# Altium project Sunfish_ECU_RevA.PrjPcb
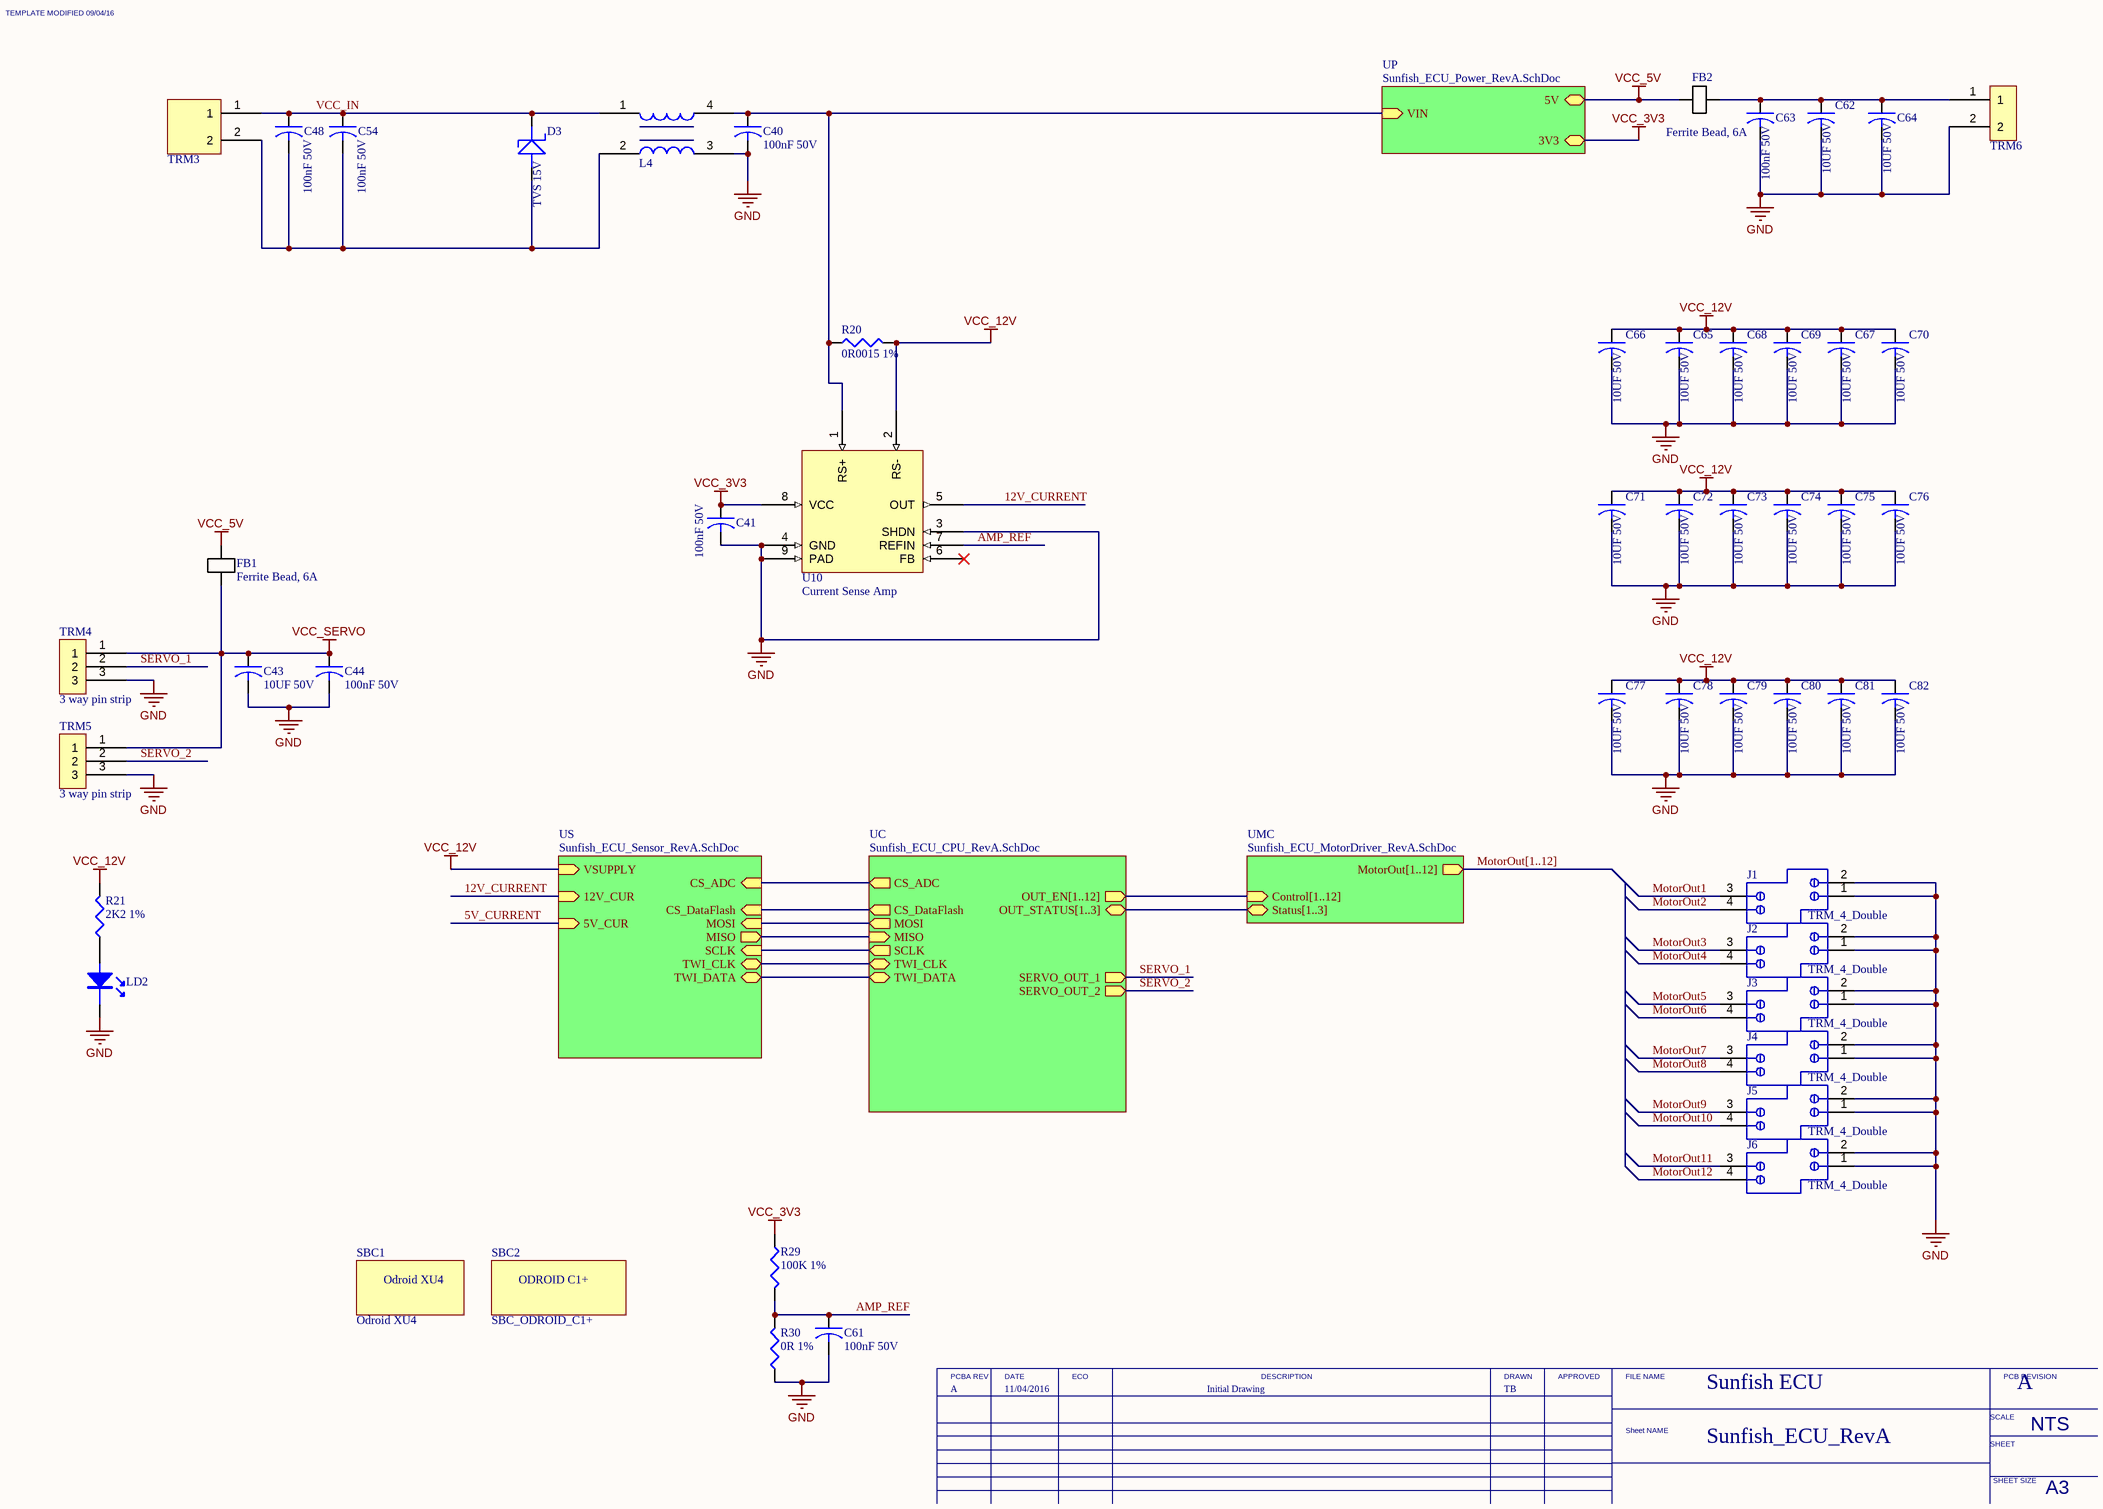
[diagram p0: Sunfish_ECU_RevA.SchDoc]
6 sheets, 197 parts. Net scope: hierarchical (ports join the sheet entries above them; power ports are global).
Board file: Sunfish_ECU_RevA.PcbDoc
Sheets:
  Sunfish_ECU_RevA.SchDoc
    UP = Sunfish_ECU_Power_RevA.SchDoc
    UC = Sunfish_ECU_CPU_RevA.SchDoc
    UMC = Sunfish_ECU_MotorDriver_RevA.SchDoc
      UF1 = Sunfish_ECU_MotorFilter_RevA.SchDoc
      UF2 = Sunfish_ECU_MotorFilter_RevA.SchDoc
      UF3 = Sunfish_ECU_MotorFilter_RevA.SchDoc
      UF4 = Sunfish_ECU_MotorFilter_RevA.SchDoc
      UF5 = Sunfish_ECU_MotorFilter_RevA.SchDoc
      UF6 = Sunfish_ECU_MotorFilter_RevA.SchDoc
      UF7 = Sunfish_ECU_MotorFilter_RevA.SchDoc
      UF8 = Sunfish_ECU_MotorFilter_RevA.SchDoc
      UF9 = Sunfish_ECU_MotorFilter_RevA.SchDoc
      UF10 = Sunfish_ECU_MotorFilter_RevA.SchDoc
      UF11 = Sunfish_ECU_MotorFilter_RevA.SchDoc
      UF12 = Sunfish_ECU_MotorFilter_RevA.SchDoc
    US = Sunfish_ECU_Sensor_RevA.SchDoc

## Sheet Sunfish_ECU_RevA.SchDoc
size A3; _PRJ_TITLE: PROJECT TITLE; _SHT_TITLE: Sheet; _REV: A; PageSetup: Record=PageOptions|CenterHorizontal=True|CenterVertical=True|PrintScale=0.71|XCorrection=1.00|YCorrection=1.00|PrintKind=0|BorderSize=5000000|LeftOffset=0|BottomOffset=0|Orientation=2|PaperLength=1000|PaperWidth=1000|Scale=100|PaperSource=258|PrintQuality=600|MediaType=1|DitherType=10|PaperKind=A3 (297x420mm)|PrintScaleMode=1

### Parts
C40  100nF 50V  [0603]
C41  100nF 50V  [0603]
C43  10UF 50V  [1206]
C44  100nF 50V  [0603]
C48  100nF 50V  [0603]
C54  100nF 50V  [0603]
C61  100nF 50V  [0603]
C62  10UF 50V  [1206]
C63  100nF 50V  [0603]
C64  10UF 50V  [1206]
C65  10UF 50V  [1206]
C66  10UF 50V  [1206]
C67  10UF 50V  [1206]
C68  10UF 50V  [1206]
C69  10UF 50V  [1206]
C70  10UF 50V  [1206]
C71  10UF 50V  [1206]
C72  10UF 50V  [1206]
C73  10UF 50V  [1206]
C74  10UF 50V  [1206]
C75  10UF 50V  [1206]
C76  10UF 50V  [1206]
C77  10UF 50V  [1206]
C78  10UF 50V  [1206]
C79  10UF 50V  [1206]
C80  10UF 50V  [1206]
C81  10UF 50V  [1206]
C82  10UF 50V  [1206]
D3  TVS 15V  [DO-214AB]
FB1  Ferrite Bead, 6A  [1806]
FB2  Ferrite Bead, 6A  [1806]
J1  TRM_4_Double  [691230110004]
J2  TRM_4_Double  [691230110004]
J3  TRM_4_Double  [691230110004]
J4  TRM_4_Double  [691230110004]
J5  TRM_4_Double  [691230110004]
J6  TRM_4_Double  [691230110004]
L4  CHOKE COM MODE ULTRA HC 100 OHMS  [Choke_CM5441Z101B-10]  (value not drawn)
LD2  Green LED 0805  [0805DIODE]  (value not drawn)
R20  0R0015 1%  [2512]
R21  2K2 1%  [0603]
R29  100K 1%  [0603]
R30  0R 1%  [0603]
SBC1  Odroid XU4  [ODROID_XU4]
SBC2  SBC_ODROID_C1+  [SBC_ODROID_C1+]
TRM3  2way screw terminal, High current  [TERM_2POS_HORIZ_7.62MM]  (value not drawn)
TRM4  3 way pin strip  [SIP_3]
TRM5  3 way pin strip  [SIP_3]
TRM6  Wurth 2way screw terminal  [TERM_2POS_HORIZ_5.08MM]  (value not drawn)
U10  Current Sense Amp  [SOIC127P600X168_HS-8M]

### Sub-sheets
UC = Sunfish_ECU_CPU_RevA.SchDoc: OUT_EN[1..12] (out), CS_ADC (out), MOSI (out), TWI_DATA (bidir), TWI_CLK (bidir), OUT_STATUS[1..3] (bidir), SCLK (out), CS_DataFlash (out), MISO (in), SERVO_OUT_1 (out), SERVO_OUT_2 (out)
UMC = Sunfish_ECU_MotorDriver_RevA.SchDoc: MotorOut[1..12] (out), Control[1..12] (in), Status[1..3] (bidir)
UP = Sunfish_ECU_Power_RevA.SchDoc: 5V (bidir), 3V3 (bidir), VIN (in)
US = Sunfish_ECU_Sensor_RevA.SchDoc: 12V_CUR (in), VSUPPLY (in), CS_ADC (in), TWI_DATA (bidir), CS_DataFlash (in), SCLK (in), TWI_CLK (bidir), MOSI (in), MISO (out), 5V_CUR (in)

### Nets
GND: C40.2 C41.2 C43.2 C44.2 C61.2 C62.2 C63.2 C64.2 C65.2 C66.2 C67.2 C68.2 C69.2 C70.2 C71.2 C72.2 C73.2 C74.2 C75.2 C76.2 C77.2 C78.2 C79.2 C80.2 C81.2 C82.2 J1.1 J1.2 J2.1 J2.2 J3.1 J3.2 J4.1 J4.2 J5.1 J5.2 J6.1 J6.2 L4.3 LD2.K R30.1 TRM4.3 TRM5.3 TRM6.2 U10.3(SHDN) U10.4(GND) U10.9(PAD)
VCC_3V3: C41.1 R29.2 U10.8(VCC) ; sheet UP/3V3
VCC_5V: FB1.1 FB2.1 ; sheet UP/5V
VCC_12V: C65.1 C66.1 C67.1 C68.1 C69.1 C70.1 C71.1 C72.1 C73.1 C74.1 C75.1 C76.1 C77.1 C78.1 C79.1 C80.1 C81.1 C82.1 R20.2 R21.2 U10.2(RS-) ; sheet US/VSUPPLY
VCC_SERVO: C43.1 C44.1 FB1.2 TRM4.1 TRM5.1
5V_CURRENT: sheet US/5V_CUR
12V_CURRENT: U10.5(OUT) ; sheet US/12V_CUR
AMP_REF: C61.1 R29.1 R30.2 U10.7(REFIN)
CS_ADC: sheet UC/CS_ADC, sheet US/CS_ADC
CS_DataFlash: sheet UC/CS_DataFlash, sheet US/CS_DataFlash
MISO: sheet UC/MISO, sheet US/MISO
MOSI: sheet UC/MOSI, sheet US/MOSI
MotorOut1: J1.3
MotorOut2: J1.4
MotorOut3: J2.3
MotorOut4: J2.4
MotorOut5: J3.3
MotorOut6: J3.4
MotorOut7: J4.3
MotorOut8: J4.4
MotorOut9: J5.3
MotorOut10: J5.4
MotorOut11: J6.3
MotorOut12: J6.4
SCLK: sheet UC/SCLK, sheet US/SCLK
SERVO_1: TRM4.2 ; sheet UC/SERVO_OUT_1
SERVO_2: TRM5.2 ; sheet UC/SERVO_OUT_2
TWI_CLK: sheet UC/TWI_CLK, sheet US/TWI_CLK
TWI_DATA: sheet UC/TWI_DATA, sheet US/TWI_DATA
VCC_IN: C48.1 C54.1 D3.K L4.1 TRM3.1
NetC40_1: C40.1 L4.4 R20.1 U10.1(RS+) ; sheet UP/VIN
NetC48_2: C48.2 C54.2 D3.A L4.2 TRM3.2
NetC62_1: C62.1 C63.1 C64.1 FB2.2 TRM6.1
NetLD2_A: LD2.A R21.1

Not connected (* = marked no-connect by the designer): U10 6(FB)*

### Buses and harness runs
bus MotorOut[1..12] = sheet UMC/MotorOut[1..12]
bus sheet UC/OUT_EN[1..12] = sheet UMC/Control[1..12]
bus sheet UC/OUT_STATUS[1..3] = sheet UMC/Status[1..3]

### Notes on the sheet
- A
- 11/04/2016
- Initial Drawing
- TB
- Sunfish ECU
- Sunfish_ECU_RevA
- TEMPLATE MODIFIED 09/04/16
- PCBA REV
- DATE
- ECO
- DESCRIPTION
- DRAWN
- APPROVED
- FILE NAME
- PCB REVISION
- Sheet NAME
- SCALE
- SHEET
- NTS
- SHEET SIZE
- A3
- (in symbol SBC_ODROID_C1+) ODROID C1+

### Library data of the parts
C40 C41 C44 C48 C54 C61 C63 = CAP_100NF_50V_10%_0603: CAP CER 100nF 50V 10% X7R 0603; Manufacturer: Murata; Manufacturer P/N: GRM188R71H104KA93D
C43 C62 C64-C82 = CAP_10UF_50V_10%_1206: CAP CER 10UF 50V 10% X5R 1206; Manufacturer: Murata; Manufacturer P/N: GRM31CR61H106KA12L
D3 = DIODE_TVS_SMCJ15A: TVS Diode, 15V; Manufacturer: LIttlefuse; Manufacturer P/N: SMCJ15A
FB1 FB2 = IND_FERRITE_ BLM41PG600SN1L: Manufacturer: MURATA; Manufacturer P/N: BLM41PG600SN1L
J1-J6 = TRM_4_Double: WR-TBL Terminal Blocks Serie 2301 - 3.50 mm with Rising Clamp; Manufacturer: Würth Elektronik eiSos GmbH; ComponentLink1 Description: Manufacturer; ComponentLink2 Description: Datasheet; NoPins: 4; Created Date: 8 Novenber 2013; partNo: 691230110004; ComponentLink1URL: http://www.we-online.com; ComponentLink2URL: http://katalog.we-online.de/em/datasheet/6912301100xx.pdf; Created by: Karrer Zheng
L4 = CHOKE_COM_MODE_100MHz: Manufacturer: Laird-Signal Integrity Products; Manufacturer P/N: CM5441Z101B-10
LD2 = LED_Green_0805: WL-SMCW SMD CHIP LED WATERCLEAR; Manufacturer: Wurth; Manufacturer P/N: 150080VS75000
R20 = RES_0R0015_1%_2512: Resistor, 0R0015, 1%, 2512; Manufacturer: Riedon; Manufacturer P/N: CSR2512C0R0015F
R21 = RES_2K2_1%_0603: Resistor, 2K2, 1%, 0603; Manufacturer: Bourns Inc; Manufacturer P/N: CR0603-FX-2201ELF
R29 = RES_100K_1%_0603: Resistor, 100K, 1%, 0603; Manufacturer: Bourns Inc; Manufacturer P/N: CRT0603-BY-1003ELF
R30 = RES_0R_1%_0603_1: Resistor, 0R, 1%, 0603; Manufacturer: Bourns Inc; Manufacturer P/N: CR0603-J/-000ELF
SBC1 = SBC_ODROID_XU4
TRM3 = TRM_2way_ScrewTerminal_7.62mm: TERM BLOCK 2POS HORIZ 7.62MM T/H; Manufacturer: Altronics; Manufacturer P/N: P4343
TRM4 TRM5 = TRM_3WaySocket: Manufacturer: N/A; Manufacturer P/N: N/A
TRM6 = TRM_2way_ScrewTerminal: TERM BLOCK 2POS HORIZ 5.08MM T/H; Manufacturer: Wurth Electronics Inc; Manufacturer P/N: 691216510002
U10 = IC_OPAMP_MAX9920+: IC OPAMP CURR SENSE 230KHZ 8SOIC; Manufacturer: Maxim Intergrated; Manufacturer P/N: MAX9920ASA+

## Sheet Sunfish_ECU_Power_RevA.SchDoc
size A3; _PRJ_TITLE: PROJECT TITLE; _SHT_TITLE: Sheet; _REV: A; PageSetup: Record=PageOptions|CenterHorizontal=True|CenterVertical=True|PrintScale=0.71|XCorrection=1.00|YCorrection=1.00|PrintKind=0|BorderSize=5000000|LeftOffset=0|BottomOffset=0|Orientation=2|PaperLength=1000|PaperWidth=1000|Scale=100|PaperSource=258|PrintQuality=600|MediaType=1|DitherType=10|PaperKind=A3 (297x420mm)|PrintScaleMode=1
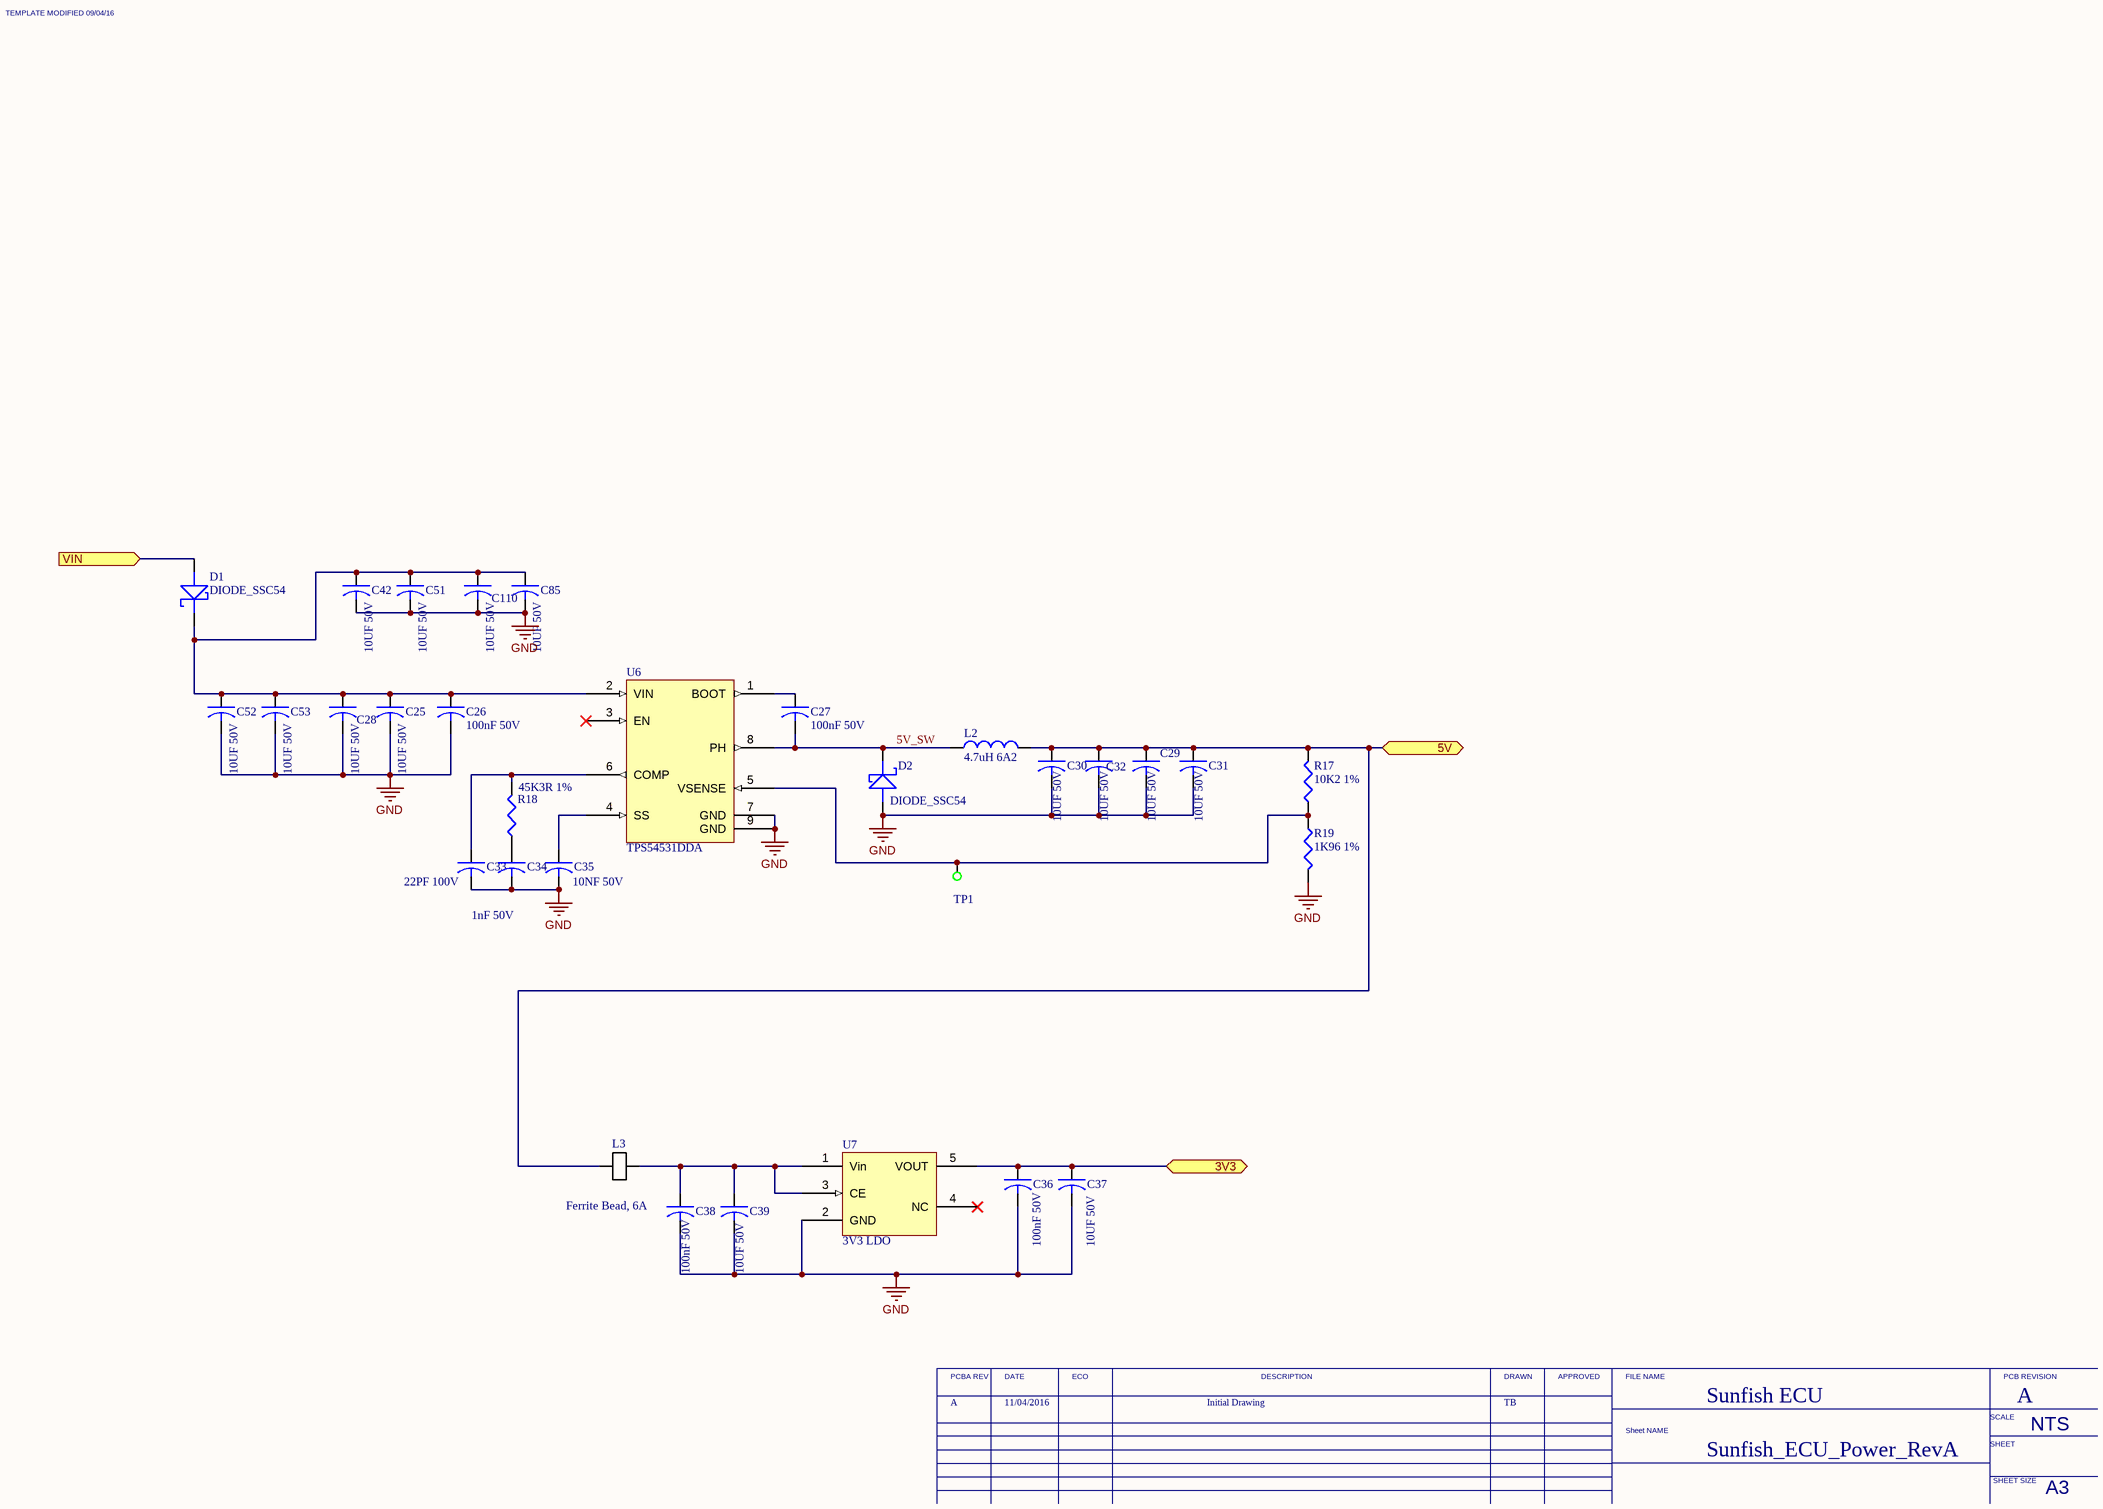
[diagram p1: Sunfish_ECU_Power_RevA.SchDoc]

### Parts
C25  10UF 50V  [1206]
C26  100nF 50V  [0603]
C27  100nF 50V  [0603]
C28  10UF 50V  [1206]
C29  10UF 50V  [1206]
C30  10UF 50V  [1206]
C31  10UF 50V  [1206]
C32  10UF 50V  [1206]
C33  22PF 100V  [0603]
C34  1nF 50V  [0603]
C35  10NF 50V  [0603]
C36  100nF 50V  [0603]
C37  10UF 50V  [1206]
C38  100nF 50V  [0603]
C39  10UF 50V  [1206]
C42  10UF 50V  [1206]
C51  10UF 50V  [1206]
C52  10UF 50V  [1206]
C53  10UF 50V  [1206]
C85  10UF 50V  [1206]
C110  10UF 50V  [1206]
D1  DIODE_SSC54  [DO-214AB]
D2  DIODE_SSC54  [DO-214AB]
L2  4.7uH 6A2  [Wurth744771156]
L3  Ferrite Bead, 6A  [1806]
R17  10K2 1%  [0603]
R18  45K3R 1%  [0603]
R19  1K96 1%  [0603]
TP1  Test Point  [TP_SMT]  (value not drawn)
U6  TPS54531DDA  [PSOP-8]
U7  3V3 LDO  [SOT-25-A]

### Ports
3V3 (bidir), 5V (bidir), VIN (in)

### Nets
GND: C25.2 C26.2 C28.2 C29.2 C30.2 C31.2 C32.2 C33.2 C34.2 C35.2 C36.2 C37.2 C38.2 C39.2 C42.2 C51.2 C52.2 C53.2 C85.2 C110.2 D2.A R19.2 U6.7(GND) U6.9(GND) U7.2(GND)
VCC_3V3: C36.1 C37.1 U7.5(VOUT) ; port 3V3
VCC_5V: C29.1 C30.1 C31.1 C32.1 L2.2 L3.1 R17.2 ; port 5V
5V_SW: C27.2 D2.K L2.1 U6.8(PH)
NetC25_1: C25.1 C26.1 C28.1 C42.1 C51.1 C52.1 C53.1 C85.1 C110.1 D1.K U6.2(VIN)
NetC27_1: C27.1 U6.1(BOOT)
NetC33_1: C33.1 R18.2 U6.6(COMP)
NetC34_1: C34.1 R18.1
NetC35_1: C35.1 U6.4(SS)
NetC38_1: C38.1 C39.1 L3.2 U7.1(Vin) U7.3(CE)
NetC40_1: D1.A ; port VIN
NetR17_1: R17.1 R19.1 TP1.1 U6.5(VSENSE)

Not connected (* = marked no-connect by the designer): U6 3(EN)*; U7 4(NC)*

### Notes on the sheet
- A
- 11/04/2016
- Initial Drawing
- TB
- Sunfish ECU
- Sunfish_ECU_Power_RevA
- TEMPLATE MODIFIED 09/04/16
- PCBA REV
- DATE
- ECO
- DESCRIPTION
- DRAWN
- APPROVED
- FILE NAME
- PCB REVISION
- Sheet NAME
- SCALE
- SHEET
- NTS
- SHEET SIZE
- A3

### Library data of the parts
C25 C28-C32 C37 C39 C42 C51-C53 C85 C110 = CAP_10UF_50V_10%_1206: as C43 on sheet Sunfish_ECU_RevA
C26 C27 C36 C38 = CAP_100NF_50V_10%_0603: as C40 on sheet Sunfish_ECU_RevA
C33 = CAP_22PF_100V_5%_0603: CAP CER 22PF 100V 5% NP0 0603; Manufacturer: Murata; Manufacturer P/N: GRM1885C2A220JA01D
C34 = CAP_1NF_50V_10%_0603: CAP CER 1nF 50V 10% X7R 0603; Manufacturer: Murata; Manufacturer P/N: GRM188R71H102KA01D
C35 = CAP_10NF_50V_10%_0603: CAP CER 10NF 50V 10% X7R 0603; Manufacturer: Murata; Manufacturer P/N: GRM188R71H103KA01D
D1 D2 = DIODE_SSC54: Schottky Diode, 5A, 40V SSC54, DO214AB; Manufacturer: Vishay; Manufacturer P/N: SSC54-E3/9AT
L2 = IND_4.7uH_6A2: FIXED IND 4.7UH 6.2A 34 MOHM; Manufacturer: Wurth Electronics Inc; Manufacturer P/N: 74437356047
L3 = IND_FERRITE_ BLM41PG600SN1L: Manufacturer: MURATA; Manufacturer P/N: BLM41PG600SN1L
R17 = RES_10K2_1%_0603: Resistor, 10K2, 1%, 0603; Manufacturer: Yageo; Manufacturer P/N: RC0603FR-0710K2L
R18 = RES_45K3_1%_0603: Resistor, 45K3, 1%, 0603; Manufacturer: Bourns Inc; Manufacturer P/N: CR0603-FX-4532ELF
R19 = RES_1K96_1%_0603: Resistor, 1K96, 1%, 0603; Manufacturer: Yageo; Manufacturer P/N: RC0603FR-071K96L
TP1 = MISC_TP_SMT: Probe compatible test point; Manufacturer: N/A; Manufacturer P/N: N/A
U6 = IC_SMPS_TPS54531: SMPS; Manufacturer: TI; Manufacturer P/N: TPS54531DDA
U7 = IC_XC6210B332MR-G: IC REG LDO 3.3V 0.7A SOT25; Manufacturer: Torex Semiconductor Ltd; Manufacturer P/N: XC6210B332MR-G

## Sheet Sunfish_ECU_CPU_RevA.SchDoc
size A3; _PRJ_TITLE: PROJECT TITLE; _SHT_TITLE: Sheet; _REV: A; PageSetup: Record=PageOptions|CenterHorizontal=True|CenterVertical=True|PrintScale=0.71|XCorrection=1.00|YCorrection=1.00|PrintKind=0|BorderSize=5000000|LeftOffset=0|BottomOffset=0|Orientation=2|PaperLength=1000|PaperWidth=1000|Scale=100|PaperSource=258|PrintQuality=600|MediaType=1|DitherType=10|PaperKind=A3 (297x420mm)|PrintScaleMode=1
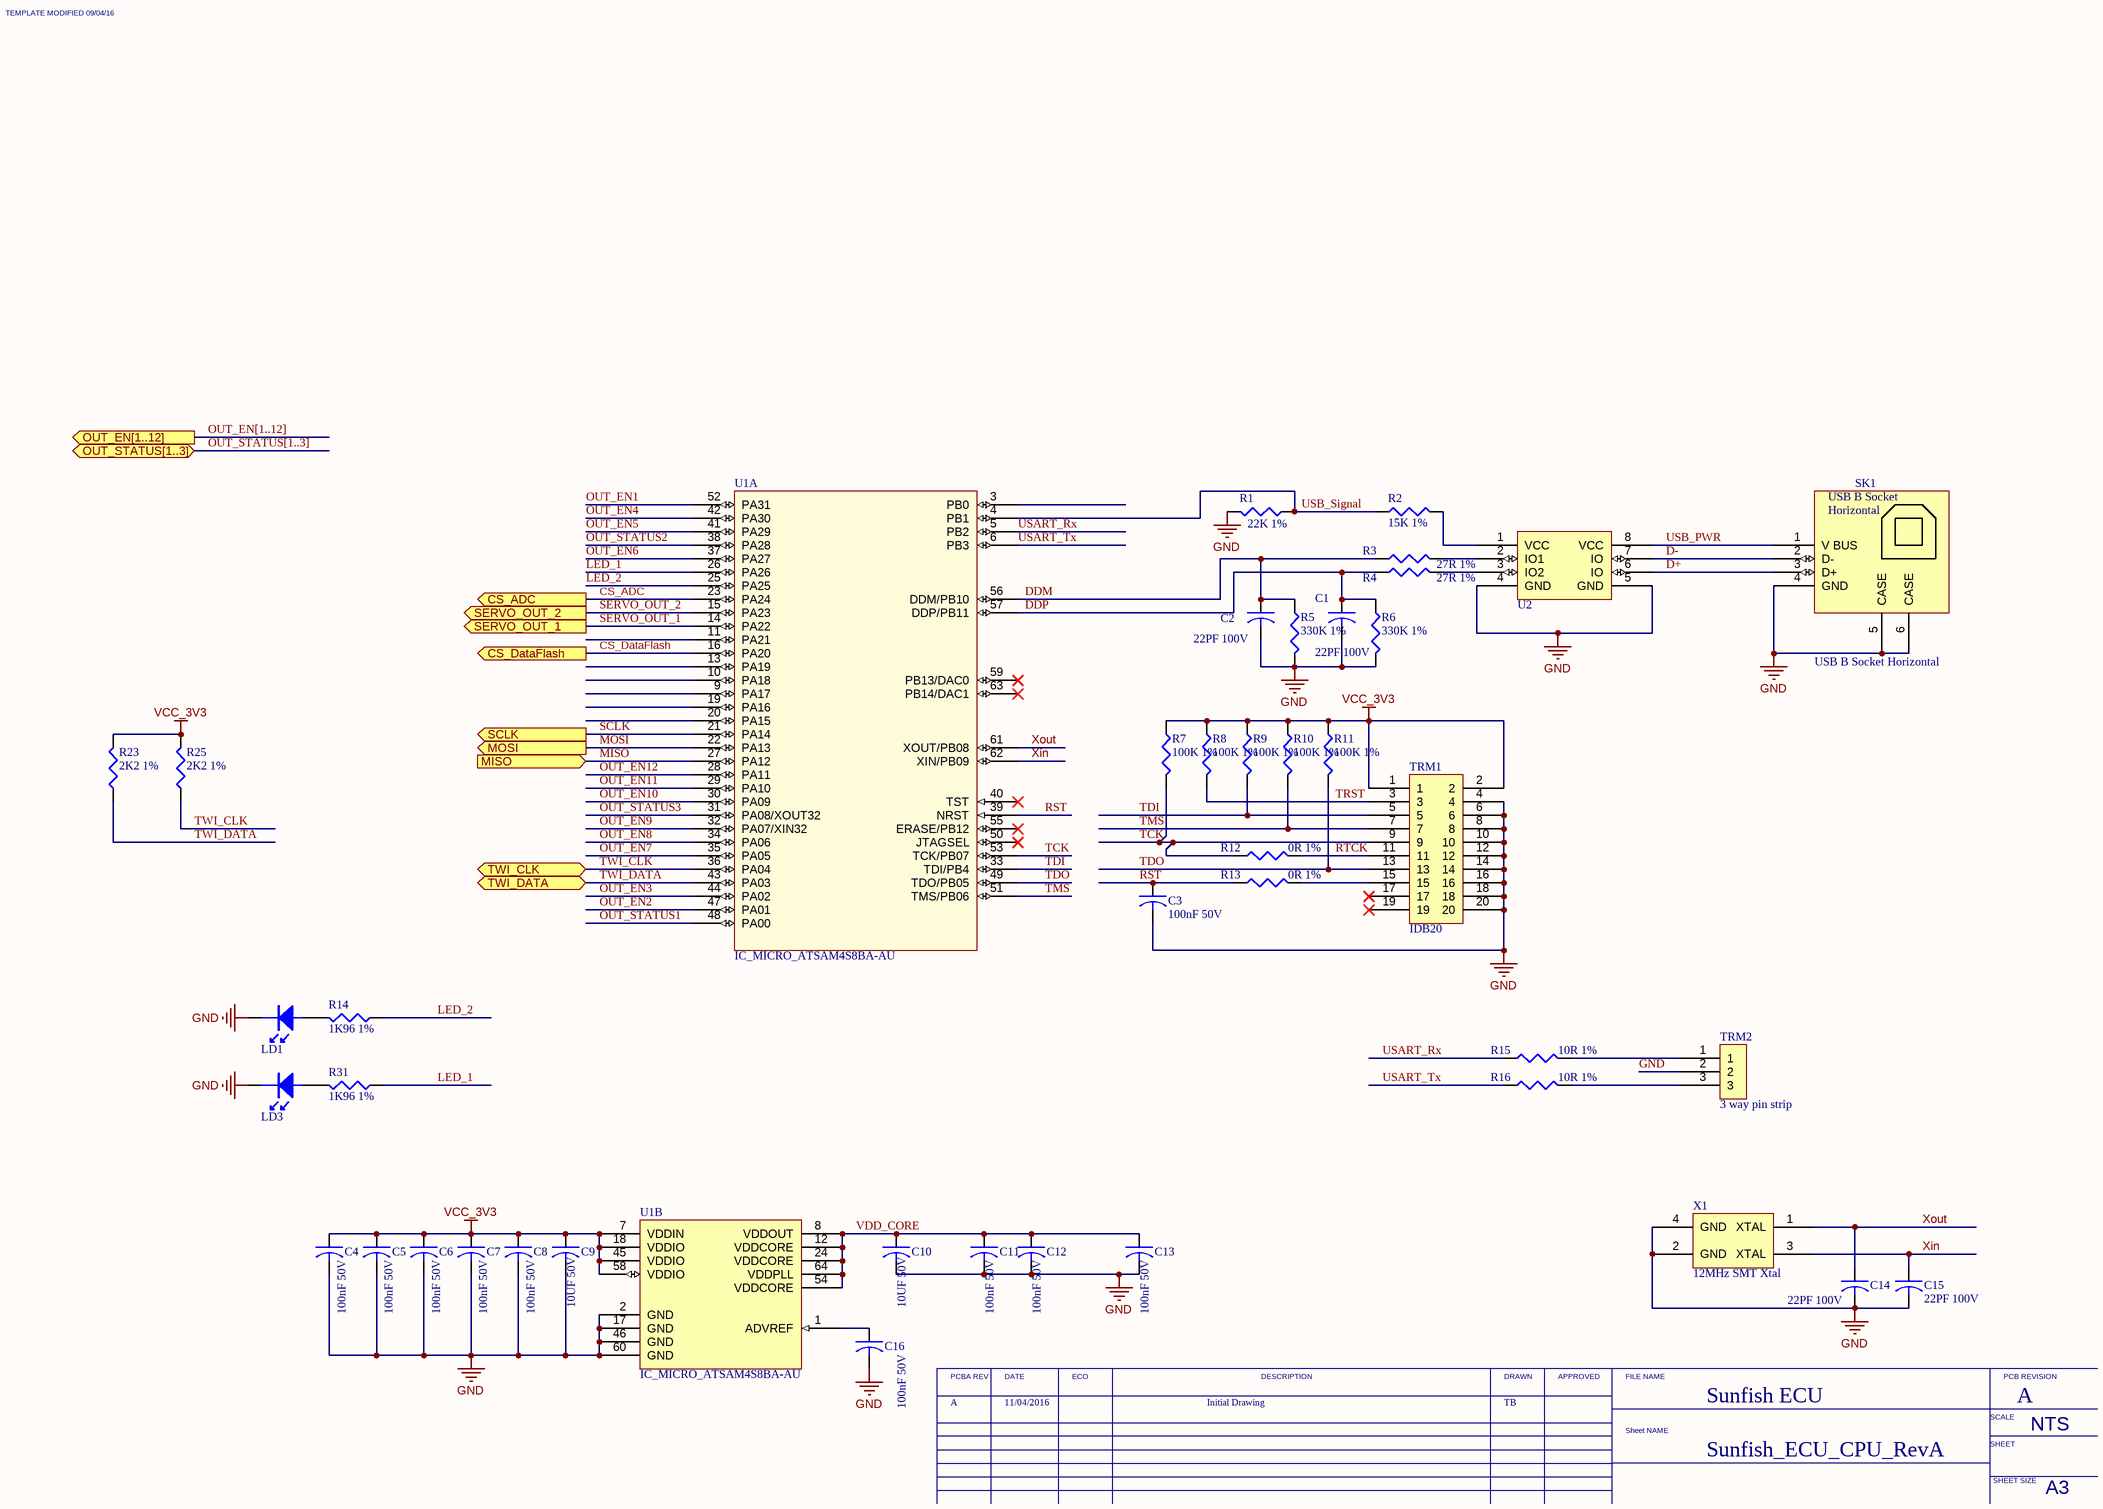
[diagram p2: Sunfish_ECU_CPU_RevA.SchDoc]

### Parts
C1  22PF 100V  [0603]
C2  22PF 100V  [0603]
C3  100nF 50V  [0603]
C4  100nF 50V  [0603]
C5  100nF 50V  [0603]
C6  100nF 50V  [0603]
C7  100nF 50V  [0603]
C8  100nF 50V  [0603]
C9  10UF 50V  [1206]
C10  10UF 50V  [1206]
C11  100nF 50V  [0603]
C12  100nF 50V  [0603]
C13  100nF 50V  [0603]
C14  22PF 100V  [0603]
C15  22PF 100V  [0603]
C16  100nF 50V  [0603]
LD1  Green LED 0805  [0805DIODE]  (value not drawn)
LD3  Green LED 0805  [0805DIODE]  (value not drawn)
R1  22K 1%  [0603]
R2  15K 1%  [0603]
R3  27R 1%  [0603]
R4  27R 1%  [0603]
R5  330K 1%  [0603]
R6  330K 1%  [0603]
R7  100K 1%  [0603]
R8  100K 1%  [0603]
R9  100K 1%  [0603]
R10  100K 1%  [0603]
R11  100K 1%  [0603]
R12  0R 1%  [0603]
R13  0R 1%  [0603]
R14  1K96 1%  [0603]
R15  10R 1%  [0603]
R16  10R 1%  [0603]
R23  2K2 1%  [0603]
R25  2K2 1%  [0603]
R31  1K96 1%  [0603]
SK1  USB B Socket Horizontal  [USB_B_Horizontal]
TRM1  IDB20  [IDC20_BOXED]
TRM2  3 way pin strip  [SIP_3]
U1  IC_MICRO_ATSAM4S8BA-AU  [TSQFP50P1200X1200X160-64M]  (parts A,B of 2)
U2  IC_USB_Transorb  [SO-8]  (value not drawn)
X1  12MHz SMT Xtal  [XTAL_5X3.2_SMD]

### Ports
CS_ADC (out), CS_DataFlash (out), MISO (in), MOSI (out), OUT_EN[1..12] (out), OUT_STATUS[1..3] (bidir), SCLK (out), SERVO_OUT_1 (out), SERVO_OUT_2 (out), TWI_CLK (bidir), TWI_DATA (bidir)

### Nets
GND: C1.2 C2.2 C3.2 C4.2 C5.2 C6.2 C7.2 C8.2 C9.2 C10.2 C11.2 C12.2 C13.2 C14.2 C15.2 C16.2 LD1.K LD3.K R1.1 R5.1 R6.1 SK1.4(GND) SK1.5(CASE) SK1.6(CASE) TRM1.4 TRM1.6 TRM1.8 TRM1.10 TRM1.12 TRM1.14 TRM1.16 TRM1.18 TRM1.20 TRM2.2 U1.2(GND) U1.17(GND) U1.46(GND) U1.60(GND) U2.4(GND) U2.5(GND) X1.2(GND) X1.4(GND)
VCC_3V3: C4.1 C5.1 C6.1 C7.1 C8.1 C9.1 R7.2 R8.2 R9.2 R10.2 R11.2 R23.2 R25.2 TRM1.1 TRM1.2 U1.7(VDDIN) U1.18(VDDIO) U1.45(VDDIO) U1.58(VDDIO)
CS_ADC: U1.23(PA24) ; port CS_ADC
CS_DataFlash: U1.16(PA20) ; port CS_DataFlash
D+: SK1.3(D+) U2.6(IO)
D-: SK1.2(D-) U2.7(IO)
DDM: C2.1 R3.2 R5.2 U1.56(DDM/PB10)
DDP: C1.1 R4.2 R6.2 U1.57(DDP/PB11)
LED_1: R31.1 U1.26(PA26)
LED_2: R14.1 U1.25(PA25)
MISO: U1.27(PA12) ; port MISO
MOSI: U1.22(PA13) ; port MOSI
OUT_EN1: U1.52(PA31)  [project net Control1]
OUT_EN2: U1.47(PA01)  [project net Control2]
OUT_EN3: U1.44(PA02)  [project net Control3]
OUT_EN4: U1.42(PA30)  [project net Control4]
OUT_EN5: U1.41(PA29)  [project net Control5]
OUT_EN6: U1.37(PA27)  [project net Control6]
OUT_EN7: U1.35(PA05)  [project net Control7]
OUT_EN8: U1.34(PA06)  [project net Control8]
OUT_EN9: U1.32(PA07/XIN32)  [project net Control9]
OUT_EN10: U1.30(PA09)  [project net Control10]
OUT_EN11: U1.29(PA10)  [project net Control11]
OUT_EN12: U1.28(PA11)  [project net Control12]
OUT_STATUS1: U1.48(PA00)
OUT_STATUS2: U1.38(PA28)
OUT_STATUS3: U1.31(PA08/XOUT32)
RST: C3.1 R13.2 U1.39(NRST)
RTCK: R12.1 TRM1.11
SCLK: U1.21(PA14) ; port SCLK
SERVO_OUT_1: U1.14(PA22) ; port SERVO_OUT_1  [project net SERVO_1]
SERVO_OUT_2: U1.15(PA23) ; port SERVO_OUT_2  [project net SERVO_2]
TCK: R7.1 R12.2 TRM1.9 U1.53(TCK/PB07)
TDI: R9.1 TRM1.5 U1.33(TDI/PB4)
TDO: R11.1 TRM1.13 U1.49(TDO/PB05)
TMS: R10.1 TRM1.7 U1.51(TMS/PB06)
TRST: R8.1 TRM1.3
TWI_CLK: R25.1 U1.36(PA04) ; port TWI_CLK
TWI_DATA: R23.1 U1.43(PA03) ; port TWI_DATA
USART_Rx: R15.1 U1.5(PB2)
USART_Tx: R16.1 U1.6(PB3)
USB_PWR: SK1.1(V_BUS) U2.8(VCC)
USB_Signal: R1.2 R2.2 U1.4(PB1)
VDD_CORE: C10.1 C11.1 C12.1 C13.1 U1.8(VDDOUT) U1.12(VDDCORE) U1.24(VDDCORE) U1.54(VDDCORE) U1.64(VDDPLL)
Xin: C15.1 U1.62(XIN/PB09) X1.3(XTAL)
Xout: C14.1 U1.61(XOUT/PB08) X1.1(XTAL)
NetC16_1: C16.1 U1.1(ADVREF)
NetLD1_A: LD1.A R14.2
NetLD3_A: LD3.A R31.2
NetR2_1: R2.1 U2.1(VCC)
NetR3_1: R3.1 U2.2(IO1)
NetR4_1: R4.1 U2.3(IO2)
NetR13_1: R13.1 TRM1.15
NetR15_2: R15.2 TRM2.1
NetR16_2: R16.2 TRM2.3

Not connected (* = marked no-connect by the designer): TRM1 17* 19*; U1 3(PB0) 9(PA17) 10(PA18) 11(PA21) 13(PA19) 19(PA16) 20(PA15) 40(TST)* 50(JTAGSEL)* 55(ERASE/PB12)* 59(PB13/DAC0)* 63(PB14/DAC1)*

### Buses and harness runs
bus OUT_EN[1..12] = port OUT_EN[1..12]
bus OUT_STATUS[1..3] = port OUT_STATUS[1..3]

### Notes on the sheet
- A
- 11/04/2016
- Initial Drawing
- TB
- Sunfish ECU
- Sunfish_ECU_CPU_RevA
- TEMPLATE MODIFIED 09/04/16
- PCBA REV
- DATE
- ECO
- DESCRIPTION
- DRAWN
- APPROVED
- FILE NAME
- PCB REVISION
- Sheet NAME
- SCALE
- SHEET
- NTS
- SHEET SIZE
- A3
- (in symbol USB_B_Horizontal) USB B Socket; Horizontal

### Library data of the parts
C1 C2 C14 C15 = CAP_22PF_100V_5%_0603: as C33 on sheet Sunfish_ECU_Power_RevA
C3-C8 C11-C13 C16 = CAP_100NF_50V_10%_0603: as C40 on sheet Sunfish_ECU_RevA
C9 C10 = CAP_10UF_50V_10%_1206: as C43 on sheet Sunfish_ECU_RevA
LD1 LD3 = LED_Green_0805: as LD2 on sheet Sunfish_ECU_RevA
R1 = RES_22K_1%_0603: Resistor, 22K, 1%, 0603; Manufacturer: Bourns Inc; Manufacturer P/N: CR0603-FX-2202ELF
R2 = RES_15K_1%_0603: Resistor, 15K, 1%, 0603; Manufacturer: Bourns Inc; Manufacturer P/N: CR0603-FX-1502ELF
R3 R4 = RES_27R_1%_0603: Resistor, 27R, 1%, 0603; Manufacturer: Bourns Inc; Manufacturer P/N: CR0603-FX-27R0ELF
R5 R6 = RES_330K_1%_0603: Resistor, 330K, 1%, 0603; Manufacturer: Bourns Inc; Manufacturer P/N: CR0603-FX-3303ELF
R7-R11 = RES_100K_1%_0603: as R29 on sheet Sunfish_ECU_RevA
R12 R13 = RES_0R_1%_0603: Resistor, 0R, 1%, 0603; Manufacturer: Bourns Inc; Manufacturer P/N: CR0603-J/-000ELF
R14 R31 = RES_1K96_1%_0603: as R19 on sheet Sunfish_ECU_Power_RevA
R15 R16 = RES_10R_1%_0603: Resistor, 10R, 1%, 0603; Manufacturer: Bourns Inc; Manufacturer P/N: CR0603-FX-10R0ELF
R23 R25 = RES_2K2_1%_0603: as R21 on sheet Sunfish_ECU_RevA
SK1 = USB_B_Horizontal: Manufacturer: Wurth Electronics Inc; Manufacturer P/N: 61400416121
TRM1 = TRM_IDC20: IDC BOX HEADER .100" 20POS; Manufacturer: CNC Tech; Manufacturer P/N: 3020-20-0100-00
TRM2 = TRM_3WaySocket: Manufacturer: N/A; Manufacturer P/N: N/A
U1 = IC_MICRO_ATSAM4S8BA-AU: 64 Pin, 512KB Flash, 128K SRAM; Manufacturer: Atmel; Manufacturer P/N: ATSAM4S8BA-AU
U2 = IC_USB_Transorb: TVS DIODE 5.25VWM 8SOIC; Manufacturer: STMicroelectronics; Manufacturer P/N: USB6B1RL
X1 = XTAL_12MHZ_SMT: Crystal 12.0000MHz 30ppm 12pF 40 Ohm -20°C - 70°C Surface Mount 4-SMD, No Lead (DFN, LCC); Manufacturer: TXC CORPORATION; Manufacturer P/N: 7B-12.000MAAE-T

## Sheet Sunfish_ECU_MotorDriver_RevA.SchDoc
size A3; _PRJ_TITLE: PROJECT TITLE; _SHT_TITLE: Sheet; _REV: A; PageSetup: Record=PageOptions|CenterHorizontal=True|CenterVertical=True|PrintScale=0.71|XCorrection=1.00|YCorrection=1.00|PrintKind=0|BorderSize=5000000|LeftOffset=0|BottomOffset=0|Orientation=2|PaperLength=1000|PaperWidth=1000|Scale=100|PaperSource=258|PrintQuality=600|MediaType=1|DitherType=10|PaperKind=A3 (297x420mm)|PrintScaleMode=1
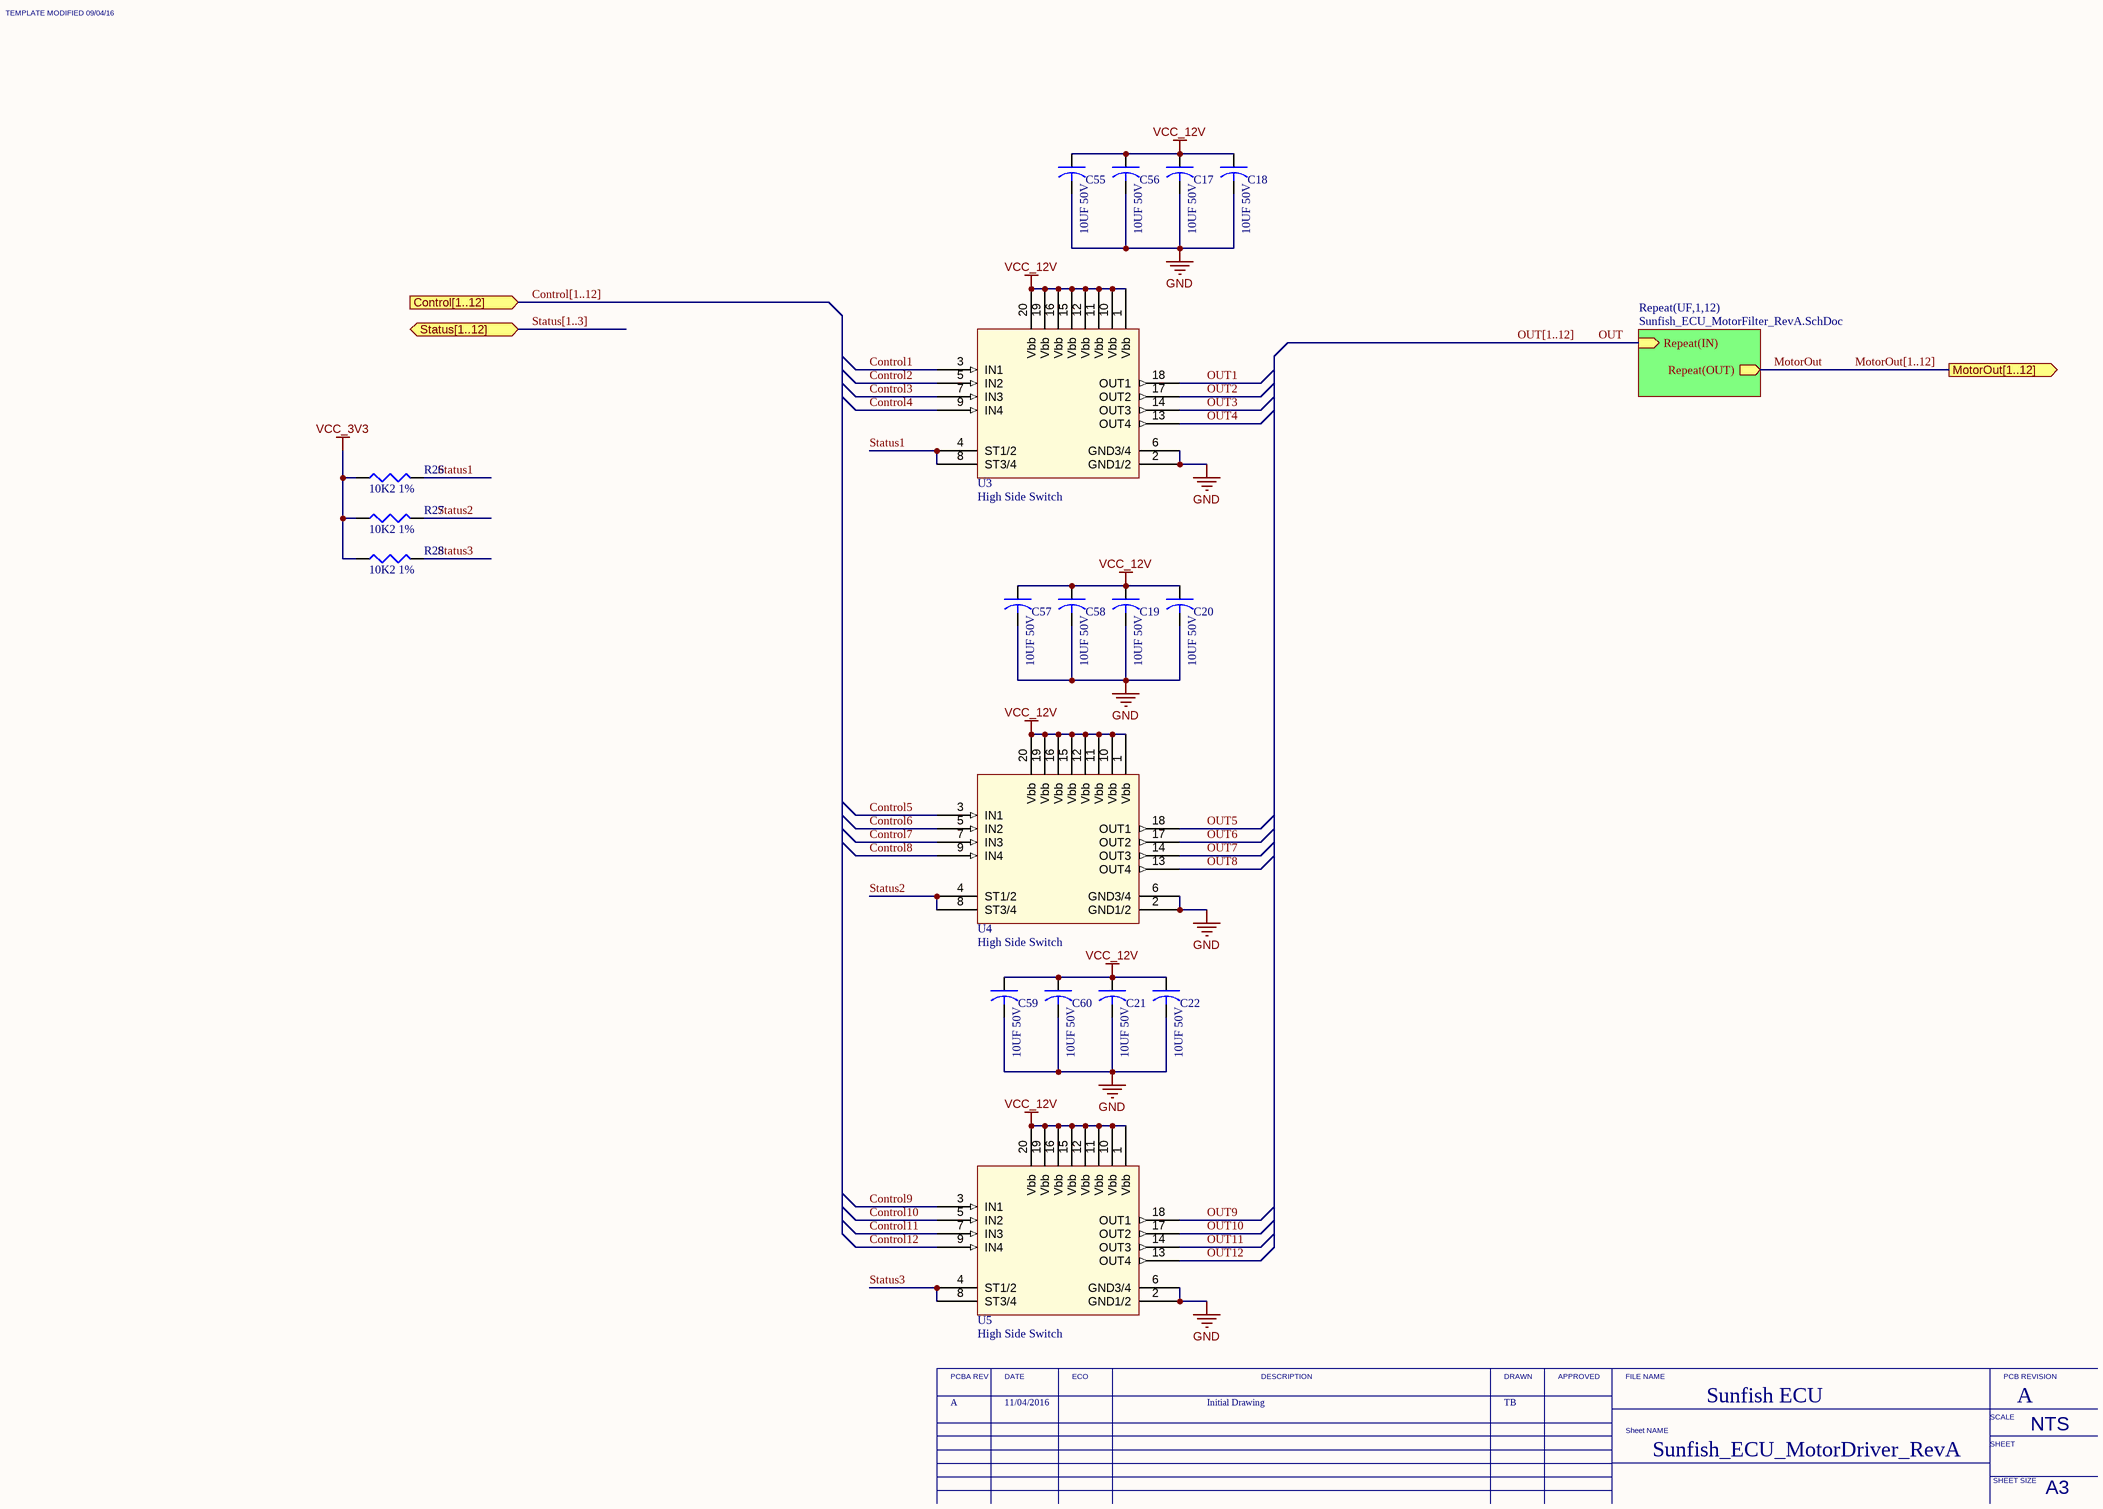
[diagram p3: Sunfish_ECU_MotorDriver_RevA.SchDoc]

### Parts
C17  10UF 50V  [1206]
C18  10UF 50V  [1206]
C19  10UF 50V  [1206]
C20  10UF 50V  [1206]
C21  10UF 50V  [1206]
C22  10UF 50V  [1206]
C55  10UF 50V  [1206]
C56  10UF 50V  [1206]
C57  10UF 50V  [1206]
C58  10UF 50V  [1206]
C59  10UF 50V  [1206]
C60  10UF 50V  [1206]
R26  10K2 1%  [0603]
R27  10K2 1%  [0603]
R28  10K2 1%  [0603]
U3  High Side Switch  [SOIC127P1030X265-20M]
U4  High Side Switch  [SOIC127P1030X265-20M]
U5  High Side Switch  [SOIC127P1030X265-20M]

### Sub-sheets
Repeat(UF,1,12) = Sunfish_ECU_MotorFilter_RevA.SchDoc: Repeat(IN) (in), Repeat(OUT) (out)

### Ports
Control[1..12] (in), MotorOut[1..12] (out), Status[1..12] (bidir)

### Nets
GND: C17.2 C18.2 C19.2 C20.2 C21.2 C22.2 C55.2 C56.2 C57.2 C58.2 C59.2 C60.2 U3.2(GND1/2) U3.6(GND3/4) U4.2(GND1/2) U4.6(GND3/4) U5.2(GND1/2) U5.6(GND3/4)
VCC_3V3: R26.1 R27.1 R28.1
VCC_12V: C17.1 C18.1 C19.1 C20.1 C21.1 C22.1 C55.1 C56.1 C57.1 C58.1 C59.1 C60.1 U3.1(Vbb) U3.10(Vbb) U3.11(Vbb) U3.12(Vbb) U3.15(Vbb) U3.16(Vbb) U3.19(Vbb) U3.20(Vbb) U4.1(Vbb) U4.10(Vbb) U4.11(Vbb) U4.12(Vbb) U4.15(Vbb) U4.16(Vbb) U4.19(Vbb) U4.20(Vbb) U5.1(Vbb) U5.10(Vbb) U5.11(Vbb) U5.12(Vbb) U5.15(Vbb) U5.16(Vbb) U5.19(Vbb) U5.20(Vbb)
Control1: U3.3(IN1)
Control2: U3.5(IN2)
Control3: U3.7(IN3)
Control4: U3.9(IN4)
Control5: U4.3(IN1)
Control6: U4.5(IN2)
Control7: U4.7(IN3)
Control8: U4.9(IN4)
Control9: U5.3(IN1)
Control10: U5.5(IN2)
Control11: U5.7(IN3)
Control12: U5.9(IN4)
MotorOut: sheet Repeat(UF,1,12)/Repeat(OUT)
OUT: sheet Repeat(UF,1,12)/Repeat(IN)
OUT1: U3.18(OUT1)
OUT2: U3.17(OUT2)
OUT3: U3.14(OUT3)
OUT4: U3.13(OUT4)
OUT5: U4.18(OUT1)
OUT6: U4.17(OUT2)
OUT7: U4.14(OUT3)
OUT8: U4.13(OUT4)
OUT9: U5.18(OUT1)
OUT10: U5.17(OUT2)
OUT11: U5.14(OUT3)
OUT12: U5.13(OUT4)
Status1: R26.2 U3.4(ST1/2) U3.8(ST3/4)
Status2: R27.2 U4.4(ST1/2) U4.8(ST3/4)
Status3: R28.2 U5.4(ST1/2) U5.8(ST3/4)

### Buses and harness runs
bus Control[1..12] = port Control[1..12]
bus MotorOut[1..12] = port MotorOut[1..12]
bus OUT[1..12]
bus Status[1..3] = port Status[1..12]

### Notes on the sheet
- A
- 11/04/2016
- Initial Drawing
- TB
- Sunfish_ECU_MotorDriver_RevA
- Sunfish ECU
- TEMPLATE MODIFIED 09/04/16
- PCBA REV
- DATE
- ECO
- DESCRIPTION
- DRAWN
- APPROVED
- FILE NAME
- PCB REVISION
- Sheet NAME
- SCALE
- SHEET
- NTS
- SHEET SIZE
- A3

### Library data of the parts
C17-C22 C55-C60 = CAP_10UF_50V_10%_1206: as C43 on sheet Sunfish_ECU_RevA
R26-R28 = RES_10K2_1%_0603: as R17 on sheet Sunfish_ECU_Power_RevA
U3-U5 = IC_HSS_BTS724G: IC HISIDE PWR SWITCH 4CH PDSO-20; Manufacturer: Infineon; Manufacturer P/N: BTS724GXUMA1

## Sheet Sunfish_ECU_MotorFilter_RevA.SchDoc
size A3; _PRJ_TITLE: PROJECT TITLE; _SHT_TITLE: Sheet; _REV: A; PageSetup: Record=PageOptions|CenterHorizontal=True|CenterVertical=True|PrintScale=0.71|XCorrection=1.00|YCorrection=1.00|PrintKind=0|BorderSize=5000000|LeftOffset=0|BottomOffset=0|Orientation=2|PaperLength=1000|PaperWidth=1000|Scale=100|PaperSource=258|PrintQuality=600|MediaType=1|DitherType=10|PaperKind=A3 (297x420mm)|PrintScaleMode=1
Used 12 times, as channels UMC/UF1, UMC/UF2, UMC/UF3, UMC/UF4, UMC/UF5, UMC/UF6, UMC/UF7, UMC/UF8, UMC/UF9, UMC/UF10, UMC/UF11, UMC/UF12. Parts and nets are listed once, with the designators drawn on the sheet.
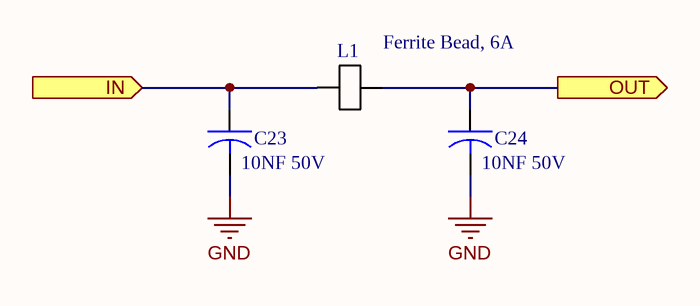
[diagram p4: Sunfish_ECU_MotorFilter_RevA.SchDoc]

### Parts
C23  10NF 50V  [0603]
C24  10NF 50V  [0603]
L1  Ferrite Bead, 6A  [1806]

### Ports
IN (in), OUT (out)

### Nets
GND: C23.2 C24.2
IN: C23.1 L1.1 ; port IN
OUT: C24.1 L1.2 ; port OUT

### Channels
UMC/UF1: designators end in _UF1; ports IN=OUT1 OUT=MotorOut1
UMC/UF2: designators end in _UF2; ports IN=OUT2 OUT=MotorOut2
UMC/UF3: designators end in _UF3; ports IN=OUT3 OUT=MotorOut3
UMC/UF4: designators end in _UF4; ports IN=OUT4 OUT=MotorOut4
UMC/UF5: designators end in _UF5; ports IN=OUT5 OUT=MotorOut5
UMC/UF6: designators end in _UF6; ports IN=OUT6 OUT=MotorOut6
UMC/UF7: designators end in _UF7; ports IN=OUT7 OUT=MotorOut7
UMC/UF8: designators end in _UF8; ports IN=OUT8 OUT=MotorOut8
UMC/UF9: designators end in _UF9; ports IN=OUT9 OUT=MotorOut9
UMC/UF10: designators end in _UF10; ports IN=OUT10 OUT=MotorOut10
UMC/UF11: designators end in _UF11; ports IN=OUT11 OUT=MotorOut11
UMC/UF12: designators end in _UF12; ports IN=OUT12 OUT=MotorOut12

### Notes on the sheet
- TEMPLATE MODIFIED 09/04/16
- PCBA REV
- DATE
- ECO
- DESCRIPTION
- DRAWN
- APPROVED
- FILE NAME
- PCB REVISION
- Sheet NAME
- SCALE
- SHEET
- NTS
- SHEET SIZE
- A3

### Library data of the parts
C23 C24 = CAP_10NF_50V_10%_0603: as C35 on sheet Sunfish_ECU_Power_RevA
L1 = IND_FERRITE_ BLM41PG600SN1L: Manufacturer: MURATA; Manufacturer P/N: BLM41PG600SN1L

## Sheet Sunfish_ECU_Sensor_RevA.SchDoc
size A3; _PRJ_TITLE: PROJECT TITLE; _SHT_TITLE: Sheet; _REV: A; PageSetup: Record=PageOptions|CenterHorizontal=True|CenterVertical=True|PrintScale=0.71|XCorrection=1.00|YCorrection=1.00|PrintKind=0|BorderSize=5000000|LeftOffset=0|BottomOffset=0|Orientation=2|PaperLength=1000|PaperWidth=1000|Scale=100|PaperSource=258|PrintQuality=600|MediaType=1|DitherType=10|PaperKind=A3 (297x420mm)|PrintScaleMode=1
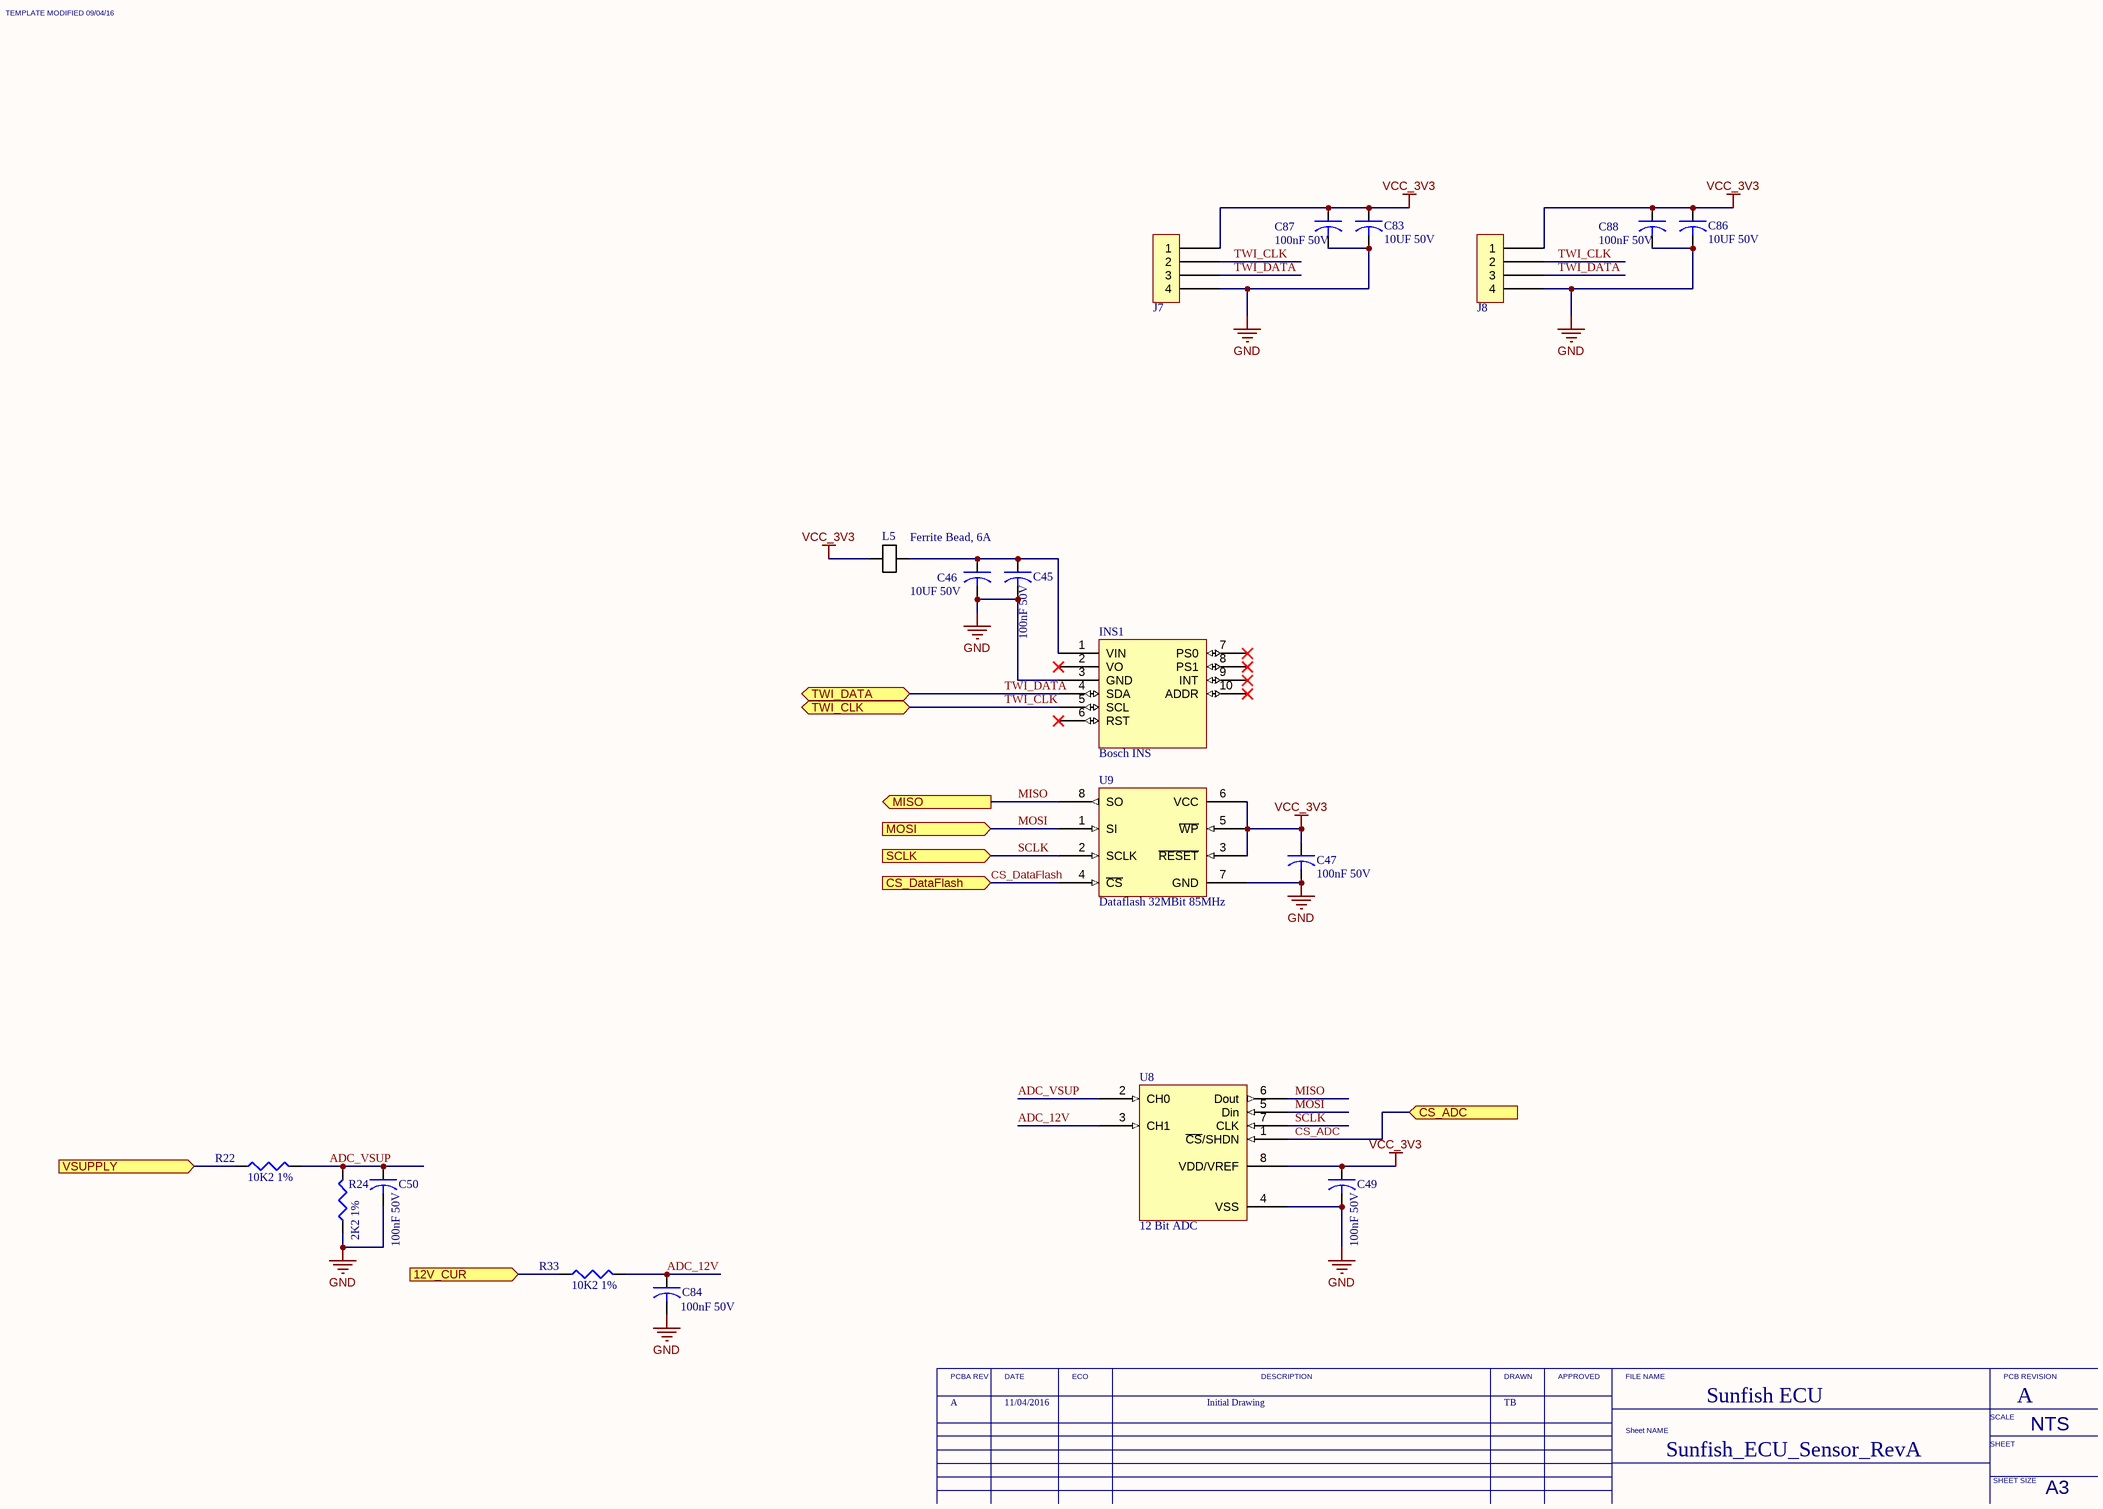
[diagram p5: Sunfish_ECU_Sensor_RevA.SchDoc]

### Parts
C45  100nF 50V  [0603]
C46  10UF 50V  [1206]
C47  100nF 50V  [0603]
C49  100nF 50V  [0603]
C50  100nF 50V  [0603]
C83  10UF 50V  [1206]
C84  100nF 50V  [0603]
C86  10UF 50V  [1206]
C87  100nF 50V  [0603]
C88  100nF 50V  [0603]
INS1  Bosch INS  [IC_INC_BNO055]
J7  4 Positions Header, Shrouded Connector 0.049" (1.25mm) Through Hole Tin  [DF13-4P-1.25DSA]  (value not drawn)
J8  4 Positions Header, Shrouded Connector 0.049" (1.25mm) Through Hole Tin  [DF13-4P-1.25DSA]  (value not drawn)
L5  Ferrite Bead, 6A  [1806]
R22  10K2 1%  [0603]
R24  2K2 1%  [0603]
R33  10K2 1%  [0603]
U8  12 Bit ADC  [SO-8]
U9  Dataflash 32MBit 85MHz  [SOIC127P800X216-8M]

### Ports
12V_CUR (in), CS_ADC (in), CS_DataFlash (in), MISO (out), MOSI (in), SCLK (in), TWI_CLK (bidir), TWI_DATA (bidir), VSUPPLY (in)

### Nets
GND: C45.2 C46.2 C47.2 C49.2 C50.2 C83.2 C84.2 C86.2 C87.2 C88.2 INS1.3(GND) J7.4 J8.4 R24.1 U8.4(VSS) U9.7(GND)
VCC_3V3: C47.1 C49.1 C83.1 C86.1 C87.1 C88.1 J7.1 J8.1 L5.1 U8.8(VDD/VREF) U9.3(~{RESET}) U9.5(~{WP}) U9.6(VCC)
VCC_12V: R22.1 ; port VSUPPLY
12V_CURRENT: R33.1 ; port 12V_CUR
ADC_12V: C84.1 R33.2 U8.3(CH1)
ADC_VSUP: C50.1 R22.2 R24.2 U8.2(CH0)
CS_ADC: U8.1(~{CS}/SHDN) ; port CS_ADC
CS_DataFlash: U9.4(~{CS}) ; port CS_DataFlash
MISO: U8.6(Dout) U9.8(SO) ; port MISO
MOSI: U8.5(Din) U9.1(SI) ; port MOSI
SCLK: U8.7(CLK) U9.2(SCLK) ; port SCLK
TWI_CLK: INS1.5(SCL) J7.2 J8.2 ; port TWI_CLK
TWI_DATA: INS1.4(SDA) J7.3 J8.3 ; port TWI_DATA
NetC45_1: C45.1 C46.1 INS1.1(VIN) L5.2

Not connected (* = marked no-connect by the designer): INS1 2(VO)* 6(RST)* 7(PS0)* 8(PS1)* 9(INT)* 10(ADDR)*

### Notes on the sheet
- A
- 11/04/2016
- Initial Drawing
- TB
- Sunfish_ECU_Sensor_RevA
- Sunfish ECU
- TEMPLATE MODIFIED 09/04/16
- PCBA REV
- DATE
- ECO
- DESCRIPTION
- DRAWN
- APPROVED
- FILE NAME
- PCB REVISION
- Sheet NAME
- SCALE
- SHEET
- NTS
- SHEET SIZE
- A3

### Library data of the parts
C45 C47 C49 C50 C84 C87 C88 = CAP_100NF_50V_10%_0603: as C40 on sheet Sunfish_ECU_RevA
C46 C83 C86 = CAP_10UF_50V_10%_1206: as C43 on sheet Sunfish_ECU_RevA
INS1 = IC_INS_BNO055
J7 J8 = CON_4_Pos_Header: Manufacturer: Hirose Electric Co Ltd; Manufacturer P/N: DF13-4P-1.25DSA
L5 = IND_FERRITE_ BLM41PG600SN1L: Manufacturer: MURATA; Manufacturer P/N: BLM41PG600SN1L
R22 R33 = RES_10K2_1%_0603: as R17 on sheet Sunfish_ECU_Power_RevA
R24 = RES_2K2_1%_0603: as R21 on sheet Sunfish_ECU_RevA
U8 = IC_ADC_MCP3202: MCP3202, 12 Bit, 2 CH ADC; Manufacturer: Microchip; Manufacturer P/N: MCP3202
U9 = IC_Dataflash_32MBit: IC DATAFLASH 32MB 85MHZ 8SOIC; Manufacturer: Adesto Technologies; Manufacturer P/N: AT45DB321E-SHF-T

## Nets that join several sheets
GND: Sunfish_ECU_RevA (47 pins), Sunfish_ECU_Power_RevA (25 pins), Sunfish_ECU_CPU_RevA (42 pins), Sunfish_ECU_MotorDriver_RevA (18 pins), UMC/UF1 (C23_UF1.2 C24_UF1.2), UMC/UF2 (C23_UF2.2 C24_UF2.2), UMC/UF3 (C23_UF3.2 C24_UF3.2), UMC/UF4 (C23_UF4.2 C24_UF4.2), UMC/UF5 (C23_UF5.2 C24_UF5.2), UMC/UF6 (C23_UF6.2 C24_UF6.2), UMC/UF7 (C23_UF7.2 C24_UF7.2), UMC/UF8 (C23_UF8.2 C24_UF8.2), UMC/UF9 (C23_UF9.2 C24_UF9.2), UMC/UF10 (C23_UF10.2 C24_UF10.2), UMC/UF11 (C23_UF11.2 C24_UF11.2), UMC/UF12 (C23_UF12.2 C24_UF12.2), Sunfish_ECU_Sensor_RevA (16 pins)
VCC_3V3: Sunfish_ECU_RevA (C41.1 R29.2 U10.8), Sunfish_ECU_Power_RevA (C36.1 C37.1 U7.5), Sunfish_ECU_CPU_RevA (19 pins), Sunfish_ECU_MotorDriver_RevA (R26.1 R27.1 R28.1), Sunfish_ECU_Sensor_RevA (13 pins)
VCC_5V: Sunfish_ECU_RevA (FB1.1 FB2.1), Sunfish_ECU_Power_RevA (7 pins)
VCC_12V: Sunfish_ECU_RevA (21 pins), Sunfish_ECU_MotorDriver_RevA (36 pins), Sunfish_ECU_Sensor_RevA (R22.1)
12V_CURRENT: Sunfish_ECU_RevA (U10.5), Sunfish_ECU_Sensor_RevA (R33.1)
Control1: Sunfish_ECU_CPU_RevA (U1.52), Sunfish_ECU_MotorDriver_RevA (U3.3)
Control2: Sunfish_ECU_CPU_RevA (U1.47), Sunfish_ECU_MotorDriver_RevA (U3.5)
Control3: Sunfish_ECU_CPU_RevA (U1.44), Sunfish_ECU_MotorDriver_RevA (U3.7)
Control4: Sunfish_ECU_CPU_RevA (U1.42), Sunfish_ECU_MotorDriver_RevA (U3.9)
Control5: Sunfish_ECU_CPU_RevA (U1.41), Sunfish_ECU_MotorDriver_RevA (U4.3)
Control6: Sunfish_ECU_CPU_RevA (U1.37), Sunfish_ECU_MotorDriver_RevA (U4.5)
Control7: Sunfish_ECU_CPU_RevA (U1.35), Sunfish_ECU_MotorDriver_RevA (U4.7)
Control8: Sunfish_ECU_CPU_RevA (U1.34), Sunfish_ECU_MotorDriver_RevA (U4.9)
Control9: Sunfish_ECU_CPU_RevA (U1.32), Sunfish_ECU_MotorDriver_RevA (U5.3)
Control10: Sunfish_ECU_CPU_RevA (U1.30), Sunfish_ECU_MotorDriver_RevA (U5.5)
Control11: Sunfish_ECU_CPU_RevA (U1.29), Sunfish_ECU_MotorDriver_RevA (U5.7)
Control12: Sunfish_ECU_CPU_RevA (U1.28), Sunfish_ECU_MotorDriver_RevA (U5.9)
CS_ADC: Sunfish_ECU_CPU_RevA (U1.23), Sunfish_ECU_Sensor_RevA (U8.1)
CS_DataFlash: Sunfish_ECU_CPU_RevA (U1.16), Sunfish_ECU_Sensor_RevA (U9.4)
MISO: Sunfish_ECU_CPU_RevA (U1.27), Sunfish_ECU_Sensor_RevA (U8.6 U9.8)
MOSI: Sunfish_ECU_CPU_RevA (U1.22), Sunfish_ECU_Sensor_RevA (U8.5 U9.1)
MotorOut1: Sunfish_ECU_RevA (J1.3), UMC/UF1 (C24_UF1.1 L1_UF1.2)
MotorOut2: Sunfish_ECU_RevA (J1.4), UMC/UF2 (C24_UF2.1 L1_UF2.2)
MotorOut3: Sunfish_ECU_RevA (J2.3), UMC/UF3 (C24_UF3.1 L1_UF3.2)
MotorOut4: Sunfish_ECU_RevA (J2.4), UMC/UF4 (C24_UF4.1 L1_UF4.2)
MotorOut5: Sunfish_ECU_RevA (J3.3), UMC/UF5 (C24_UF5.1 L1_UF5.2)
MotorOut6: Sunfish_ECU_RevA (J3.4), UMC/UF6 (C24_UF6.1 L1_UF6.2)
MotorOut7: Sunfish_ECU_RevA (J4.3), UMC/UF7 (C24_UF7.1 L1_UF7.2)
MotorOut8: Sunfish_ECU_RevA (J4.4), UMC/UF8 (C24_UF8.1 L1_UF8.2)
MotorOut9: Sunfish_ECU_RevA (J5.3), UMC/UF9 (C24_UF9.1 L1_UF9.2)
MotorOut10: Sunfish_ECU_RevA (J5.4), UMC/UF10 (C24_UF10.1 L1_UF10.2)
MotorOut11: Sunfish_ECU_RevA (J6.3), UMC/UF11 (C24_UF11.1 L1_UF11.2)
MotorOut12: Sunfish_ECU_RevA (J6.4), UMC/UF12 (C24_UF12.1 L1_UF12.2)
NetC40_1: Sunfish_ECU_RevA (C40.1 L4.4 R20.1 U10.1), Sunfish_ECU_Power_RevA (D1.A)
OUT1: Sunfish_ECU_MotorDriver_RevA (U3.18), UMC/UF1 (C23_UF1.1 L1_UF1.1)
OUT2: Sunfish_ECU_MotorDriver_RevA (U3.17), UMC/UF2 (C23_UF2.1 L1_UF2.1)
OUT3: Sunfish_ECU_MotorDriver_RevA (U3.14), UMC/UF3 (C23_UF3.1 L1_UF3.1)
OUT4: Sunfish_ECU_MotorDriver_RevA (U3.13), UMC/UF4 (C23_UF4.1 L1_UF4.1)
OUT5: Sunfish_ECU_MotorDriver_RevA (U4.18), UMC/UF5 (C23_UF5.1 L1_UF5.1)
OUT6: Sunfish_ECU_MotorDriver_RevA (U4.17), UMC/UF6 (C23_UF6.1 L1_UF6.1)
OUT7: Sunfish_ECU_MotorDriver_RevA (U4.14), UMC/UF7 (C23_UF7.1 L1_UF7.1)
OUT8: Sunfish_ECU_MotorDriver_RevA (U4.13), UMC/UF8 (C23_UF8.1 L1_UF8.1)
OUT9: Sunfish_ECU_MotorDriver_RevA (U5.18), UMC/UF9 (C23_UF9.1 L1_UF9.1)
OUT10: Sunfish_ECU_MotorDriver_RevA (U5.17), UMC/UF10 (C23_UF10.1 L1_UF10.1)
OUT11: Sunfish_ECU_MotorDriver_RevA (U5.14), UMC/UF11 (C23_UF11.1 L1_UF11.1)
OUT12: Sunfish_ECU_MotorDriver_RevA (U5.13), UMC/UF12 (C23_UF12.1 L1_UF12.1)
SCLK: Sunfish_ECU_CPU_RevA (U1.21), Sunfish_ECU_Sensor_RevA (U8.7 U9.2)
SERVO_1: Sunfish_ECU_RevA (TRM4.2), Sunfish_ECU_CPU_RevA (U1.14)
SERVO_2: Sunfish_ECU_RevA (TRM5.2), Sunfish_ECU_CPU_RevA (U1.15)
TWI_CLK: Sunfish_ECU_CPU_RevA (R25.1 U1.36), Sunfish_ECU_Sensor_RevA (INS1.5 J7.2 J8.2)
TWI_DATA: Sunfish_ECU_CPU_RevA (R23.1 U1.43), Sunfish_ECU_Sensor_RevA (INS1.4 J7.3 J8.3)